# Altium schematic sheet Sheet1.SchDoc
size A4
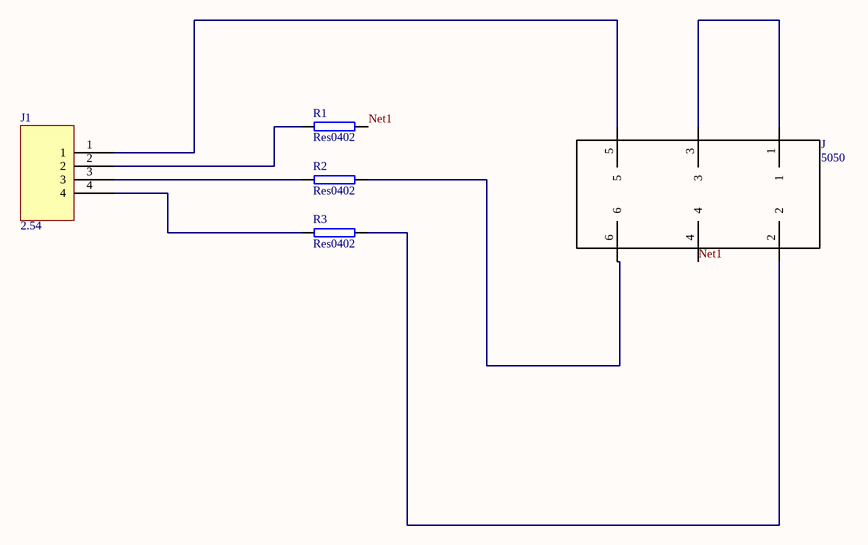
[diagram p0: Sheet1.SchDoc]

## Parts
J  5050  [5050]
J1  2.54  [pz-2.54]
R1  Res0402  [0402]
R2  Res0402  [0402]
R3  Res0402  [0402]

## Nets
Net1: J.4 R1.2
NetJ1_2: J1.2 R1.1
NetJ1_3: J1.3 R2.1
NetJ1_4: J1.4 R3.1
NetJ_1: J.1 J.3
NetJ_2: J.2 R3.2
NetJ_5: J.5 J1.1
NetJ_6: J.6 R2.2